# EAGLE design transceiver-v1 (EAGLE 9.5.2)
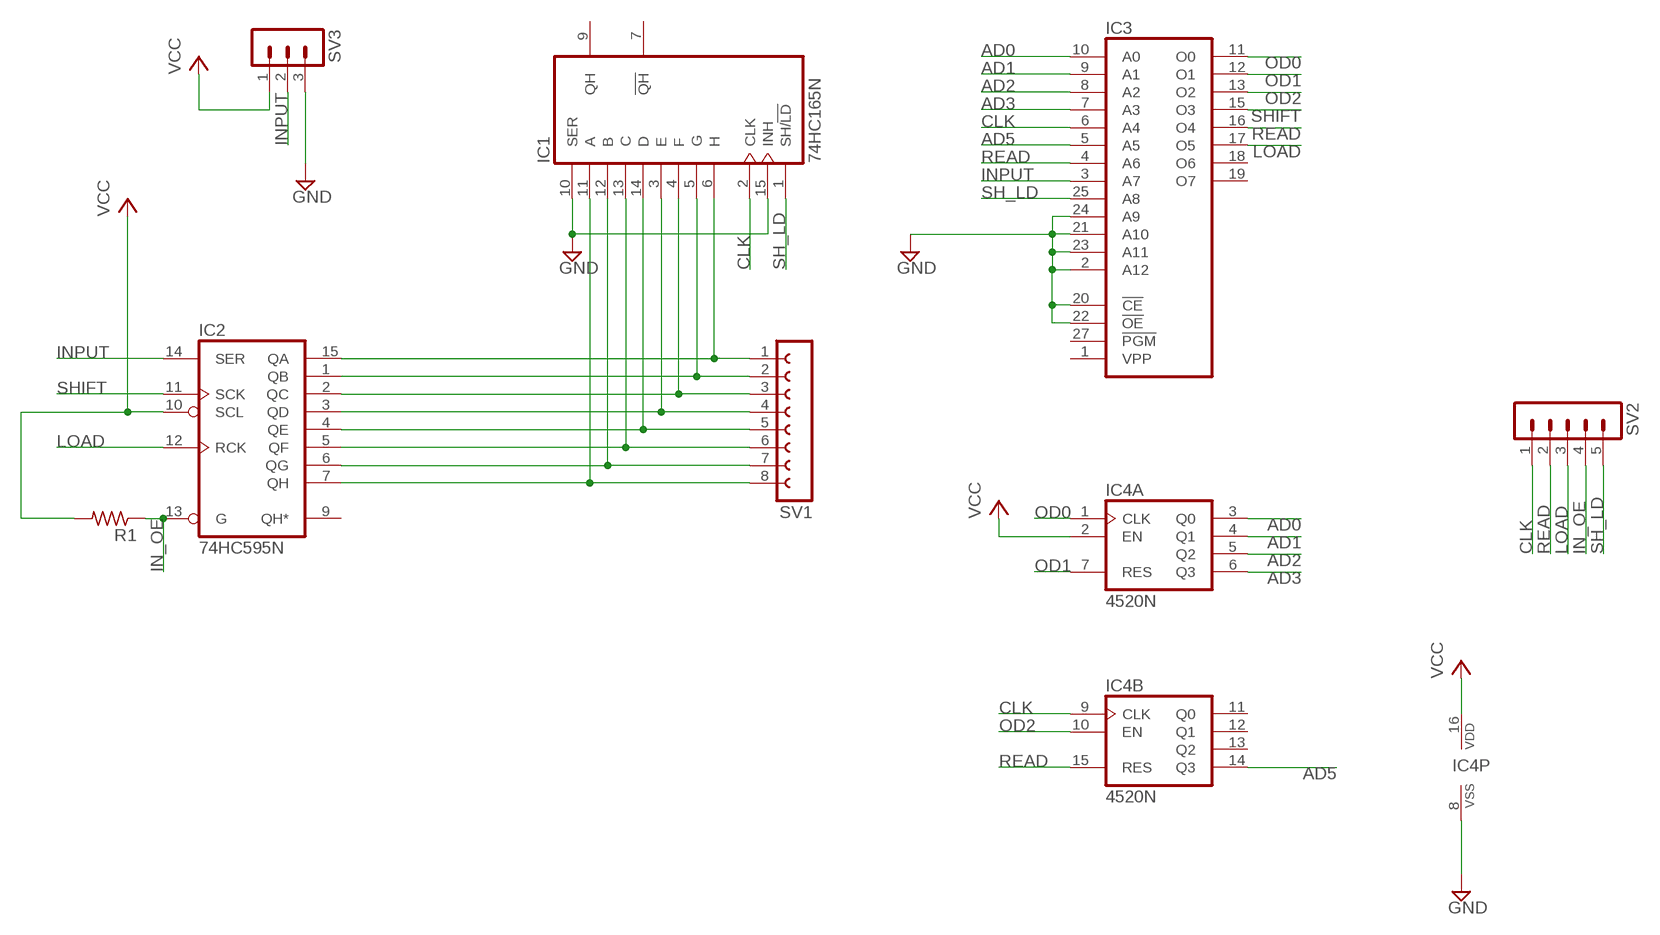
[diagram p0: schematic, sheet 1]

## Parts
IC1  74HC165N  [DIL16]
IC2  74HC595N  [DIL16]
IC3  2764  [DIL28]
IC4  4520N  [DIL16]
R1  R-US_0207/10  [0207/10]
SV1  FE08-1  [FE08]
SV2  MA05-1  [MA05-1]
SV3  MA03-1  [MA03-1]

## Nets
AD0: IC3.10(A0) IC4.3(A:Q0)
AD1: IC3.9(A1) IC4.4(A:Q1)
AD2: IC3.8(A2) IC4.5(A:Q2)
AD3: IC3.7(A3) IC4.6(A:Q3)
AD5: IC3.5(A5) IC4.14(B:Q3)
CLK: IC1.2(CLK) IC3.6(A4) IC4.9(B:CLK) SV2.1
GND: IC1.10(SER) IC1.15(INH) IC3.2(A12) IC3.20(!CE) IC3.21(A10) IC3.22(!OE) IC3.23(A11) IC3.24(A9) IC4.8(P:VSS) SV3.3
IN_OE: IC2.13(G) R1.1 SV2.4
INPUT: IC2.14(SER) IC3.3(A7) SV3.2
LOAD: IC2.12(RCK) IC3.17(O5) SV2.3
N$1: IC1.6(H) IC2.15(QA) SV1.1
N$2: IC1.5(G) IC2.1(QB) SV1.2
N$3: IC1.4(F) IC2.2(QC) SV1.3
N$4: IC1.3(E) IC2.3(QD) SV1.4
N$5: IC1.14(D) IC2.4(QE) SV1.5
N$6: IC1.13(C) IC2.5(QF) SV1.6
N$7: IC1.12(B) IC2.6(QG) SV1.7
N$8: IC1.11(A) IC2.7(QH) SV1.8
OD0: IC3.11(O0) IC4.1(A:CLK)
OD1: IC3.12(O1) IC4.7(A:RES)
OD2: IC3.13(O2) IC4.10(B:EN)
READ: IC3.4(A6) IC3.16(O4) IC4.15(B:RES) SV2.2
SH_LD: IC1.1(SH/!LD) IC3.25(A8) SV2.5
SHIFT: IC2.11(SCK) IC3.15(O3)
VCC: IC2.10(SCL) IC4.2(A:EN) IC4.16(P:VDD) R1.2 SV3.1
Unconnected: IC1.7(!QH) IC1.9(QH) IC2.9(QH*) IC3.1(VPP) IC3.18(O6) IC3.19(O7) IC3.27(!PGM) IC4.11(B:Q0) IC4.12(B:Q1) IC4.13(B:Q2)

## Power pins joined to a net without a drawn wire
GND: IC1.8(GND) IC2.8(GND) IC3.14(GND)
VCC: IC1.16(VCC) IC2.16(VCC) IC3.28(VCC)

## Library data of the parts
IC1 = 74xx-eu:74*165: 8-bit parallel load SHIFT REGISTER
IC2 = 74xx-eu:74*595: 8-bit SHIFT REGISTER, output latch
IC3 = memory:2764: MEMORY
IC4 = 45xx:4520: Dual binary up COUNTER
R1 = rcl:R-US_: RESISTOR, American symbol; SPICEPREFIX: R
SV1 = con-lsta:FE08-1: FEMALE HEADER; OC_FARNELL: unknown; OC_NEWARK: unknown
SV2 = con-lstb:MA05-1: PIN HEADER; OC_FARNELL: unknown; OC_NEWARK: unknown
SV3 = con-lstb:MA03-1: PIN HEADER; OC_FARNELL: unknown; OC_NEWARK: unknown

## Board
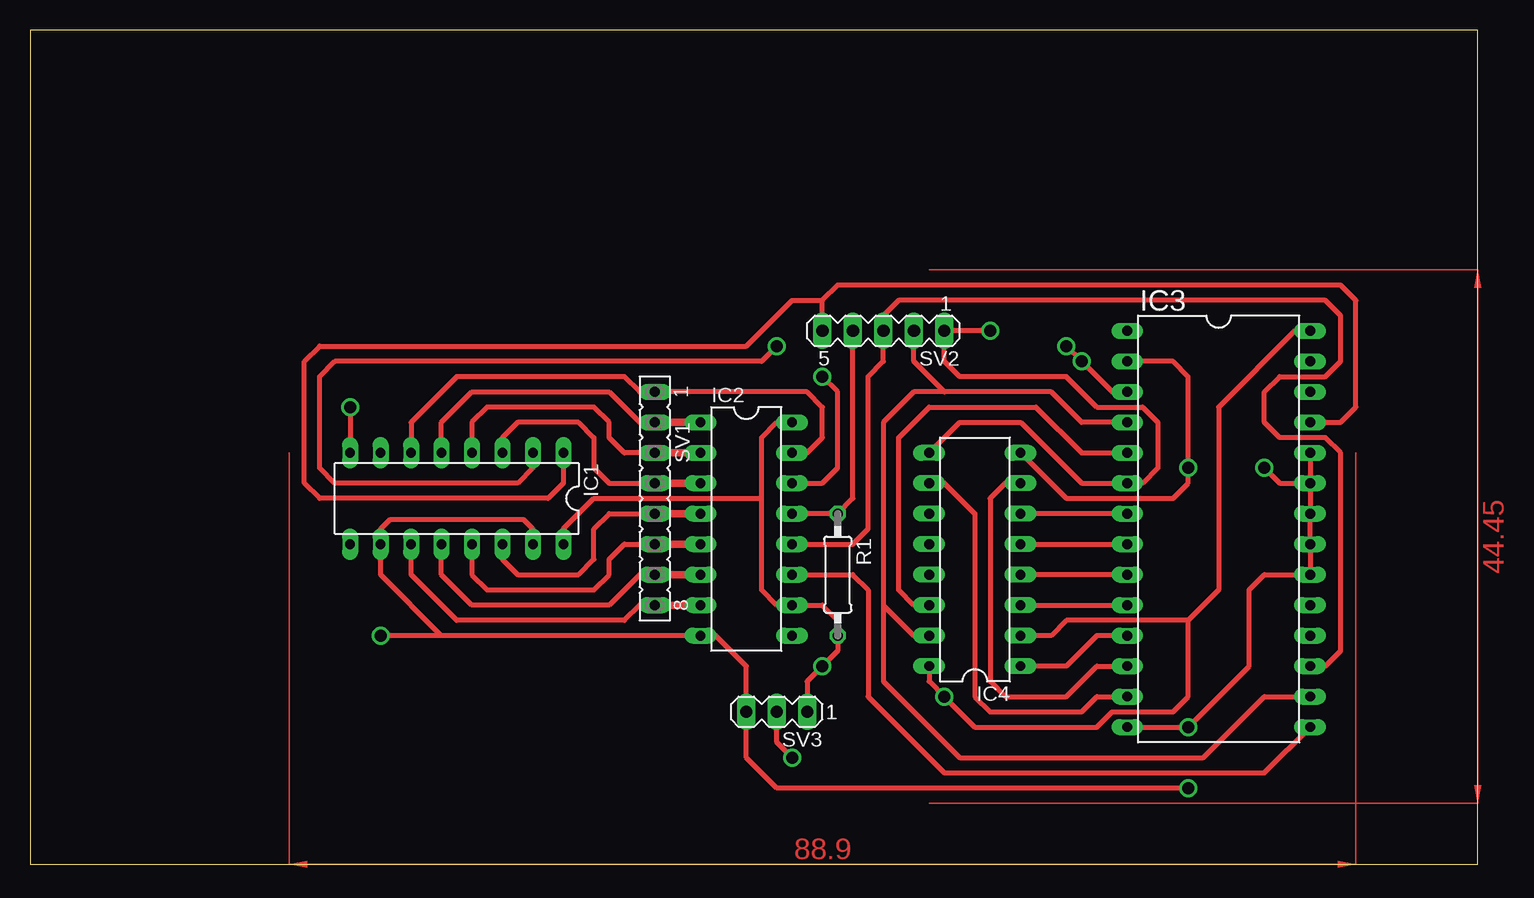
[diagram p1: board, top side]
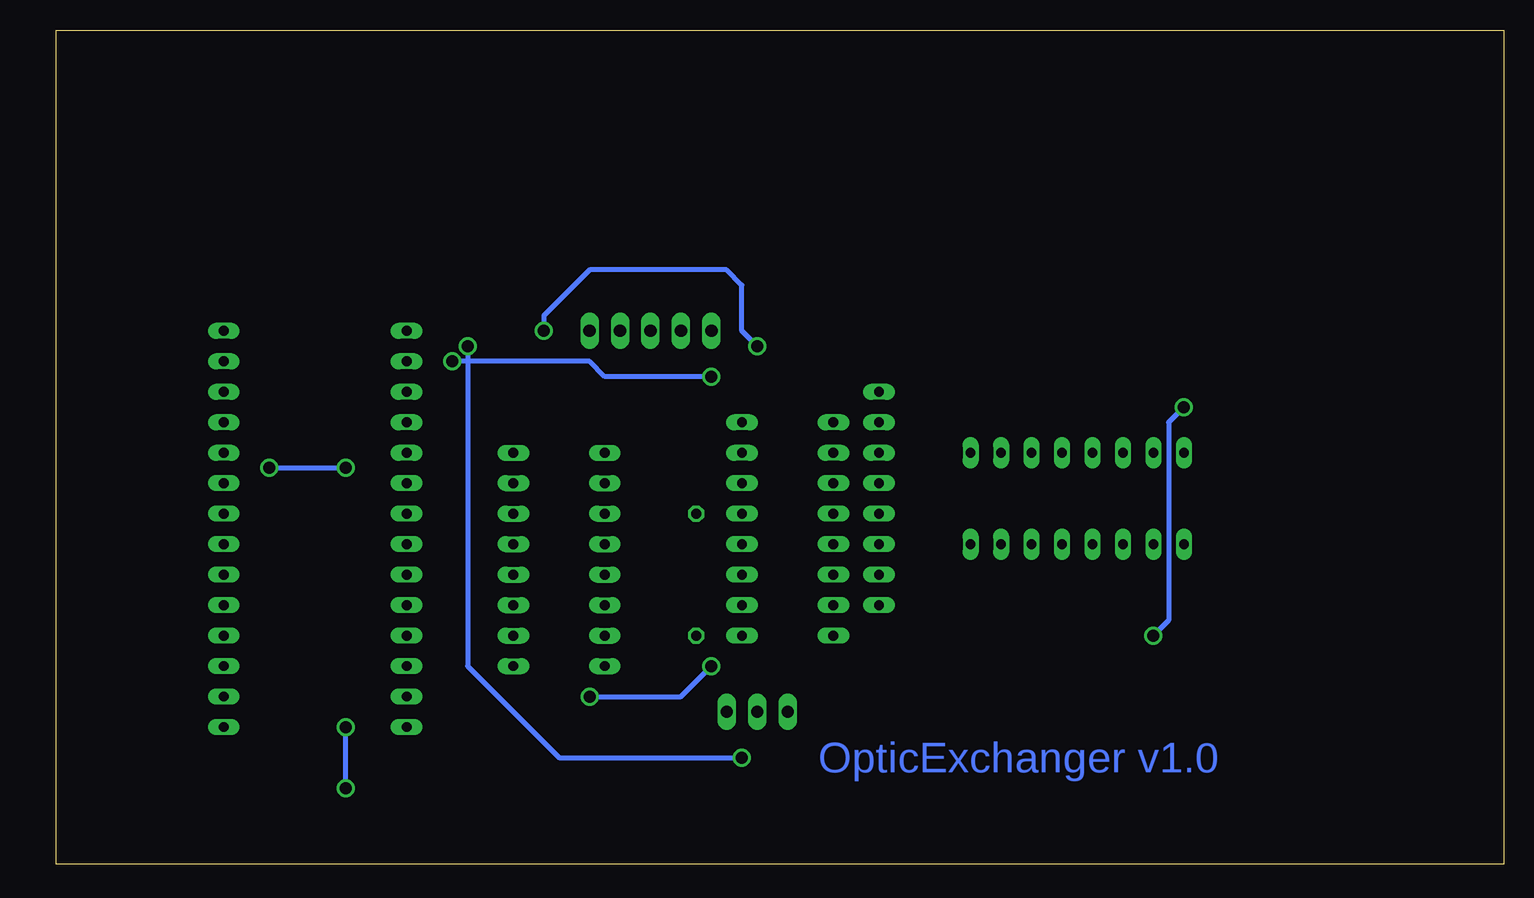
[diagram p2: board, bottom side, seen from below]

Size 120.63 x 69.52 mm. Coordinates in mm from the lower left corner, seen from the top.
Outline: 0,0 120.63,0 120.63,69.52 0,69.52 0,0
Copper layers (1*16): Top 0.035mm / dielectric 1.5mm / Bottom 0.035mm
Design rules "default": minimum track width 6mil, minimum drill 0.35mm, track to track 6mil, track to pad 6mil, pad to pad 6mil, via to via 6mil, smd to smd 6mil, copper to edge 40mil, drill to drill 6mil, minimum pad ring 10mil, minimum via ring 8mil, stop-mask expansion 4mil, vias tented up to drill 0mil, thermal gap 10mil

### Footprints (pad centres in the part's own frame; a part is rotated, then mirrored left to right if it is on the bottom)
DIL16 = drill 0.813 long: 1 -8.89,-3.81; 2 -6.35,-3.81; 3 -3.81,-3.81; 4 -1.27,-3.81; 5 1.27,-3.81; 6 3.81,-3.81; 7 6.35,-3.81; 8 8.89,-3.81; 9 8.89,3.81; 10 6.35,3.81; 11 3.81,3.81; 12 1.27,3.81; 13 -1.27,3.81; 14 -3.81,3.81; 15 -6.35,3.81; 16 -8.89,3.81
DIL28 = drill 0.813 long: 1 -16.51,-7.62; 2 -13.97,-7.62; 3 -11.43,-7.62; 4 -8.89,-7.62; 5 -6.35,-7.62; 6 -3.81,-7.62; 7 -1.27,-7.62; 8 1.27,-7.62; 9 3.81,-7.62; 10 6.35,-7.62; 11 8.89,-7.62; 12 11.43,-7.62; 13 13.97,-7.62; 14 16.51,-7.62; 15 16.51,7.62; 16 13.97,7.62; 17 11.43,7.62; 18 8.89,7.62; 19 6.35,7.62; 20 3.81,7.62; 21 1.27,7.62; 22 -1.27,7.62; 23 -3.81,7.62; 24 -6.35,7.62; 25 -8.89,7.62; 26 -11.43,7.62; 27 -13.97,7.62; 28 -16.51,7.62
0207/10 = drill 0.813 octagon: 1 -5.08,0; 2 5.08,0
FE08 = drill 0.813 long: 1 -8.89,0; 2 -6.35,0; 3 -3.81,0; 4 -1.27,0; 5 1.27,0; 6 3.81,0; 7 6.35,0; 8 8.89,0
MA05-1 = drill 1.016 long: 1 -5.08,0; 2 -2.54,0; 3 0,0; 4 2.54,0; 5 5.08,0
MA03-1 = drill 1.016 long: 1 -2.54,0; 2 0,0; 3 2.54,0

### Placement (x,y rotation side)
IC1  35.56,30.48 180 top
IC2  59.69,27.94 270 top
IC3  99.06,27.94 270 top
IC4  78.74,25.4 90 top
R1  67.31,24.13 270 top
SV1  52.07,30.48 270 top
SV2  71.12,44.45 180 top
SV3  62.23,12.7 180 top

### Tracks (layer width: path | path; a pad name or v marks a point on that pad's centre or on a via)
AD0
  Top 0.406: IC4.3 IC3.10
AD1
  Top 0.406: IC3.9 IC4.4
AD2
  Top 0.406: IC4.5 IC3.8
AD3
  Top 0.406: IC3.7 IC4.6
AD5
  Top 0.406: IC4.14 73.66,21.59 72.39,22.86 72.39,35.56 74.93,38.1 83.82,38.1 87.63,34.29 IC3.5
CLK  (via drill 1)
  Top 0.406: IC4.9 77.47,36.83 82.55,36.83 87.63,31.75 IC3.6 92.71,31.75 93.98,33.02 93.98,36.83 92.71,38.1 88.9,38.1 86.36,40.64 77.47,40.64 76.2,41.91 SV2.1 v80.01,44.45 | IC1.2 41.91,33.02 40.64,31.75 25.4,31.75 24.13,33.02 24.13,40.64 25.4,41.91 60.96,41.91 v62.23,43.18
  Bottom 0.406: v62.23,43.18 63.5,44.45 63.5,48.26 64.77,49.53 76.2,49.53 80.01,45.72 v80.01,44.45
GND  (via drill 1)
  Top 0.406: IC1.15 41.91,27.94 41.15,28.7 29.97,28.7 29.21,27.94 IC1.10 29.21,24.13 34.29,19.05 | 34.29,19.05 IC2.8 57.15,19.05 59.69,16.51 SV3.3 59.69,8.89 62.23,6.35 v96.52,6.35 | IC3.14 v96.52,11.43 101.6,16.51 101.6,22.86 102.87,24.13 IC3.20 IC3.21 IC3.22 IC3.23 | IC3.24 IC3.23 | IC4.8 86.36,30.48 95.25,30.48 96.52,31.75 v96.52,33.02 96.52,40.64 95.25,41.91 IC3.2 | 34.29,19.05 v29.21,19.05 | v26.67,38.1 IC1.8 | v102.87,33.02 104.14,31.75 IC3.23
  Bottom 0.406: v29.21,19.05 27.94,20.32 27.94,36.83 v26.67,38.1 | v102.87,33.02 v96.52,33.02 | v96.52,6.35 v96.52,11.43
IN_OE
  Top 0.406: IC2.13 R1.1 68.58,30.48 SV2.4
INPUT  (via drill 1)
  Top 0.406: IC2.14 66.04,31.75 67.31,33.02 67.31,39.37 v66.04,40.64 | IC3.3 90.17,39.37 v87.63,41.91 v86.36,43.18 | v63.5,8.89 62.23,10.16 SV3.2
  Bottom 0.406: v87.63,41.91 76.2,41.91 74.93,40.64 v66.04,40.64 | v86.36,43.18 86.36,16.51 78.74,8.89 v63.5,8.89
LOAD
  Top 0.406: IC3.17 107.95,16.51 109.22,17.78 109.22,34.29 107.95,35.56 104.14,35.56 102.87,36.83 102.87,39.37 104.14,40.64 107.95,40.64 109.22,41.91 109.22,45.72 107.95,46.99 72.39,46.99 71.12,45.72 SV2.3 71.12,41.91 69.85,40.64 69.85,27.94 68.58,26.67 IC2.12
N$1
  Top 0.406: IC1.6 31.75,36.83 35.56,40.64 49.53,40.64 50.8,39.37 SV1.1 64.77,39.37 66.04,38.1 66.04,35.56 64.77,34.29 IC2.15
N$2
  Top 0.406: IC1.5 34.29,36.83 36.83,39.37 48.26,39.37 50.8,36.83 SV1.2
  Top 0.61: IC2.1 SV1.2
N$3
  Top 0.406: SV1.3 49.53,34.29 48.26,35.56 48.26,36.83 46.99,38.1 38.1,38.1 36.83,36.83 IC1.4
  Top 0.61: IC2.2 SV1.3
N$4
  Top 0.406: SV1.4 48.26,31.75 46.99,33.02 46.99,35.56 45.72,36.83 40.64,36.83 39.37,35.56 IC1.3
  Top 0.61: IC2.3 SV1.4
N$5
  Top 0.406: SV1.5 48.26,29.21 46.99,27.94 46.99,25.4 45.72,24.13 40.64,24.13 39.37,25.4 IC1.14
  Top 0.61: IC2.4 SV1.5
N$6
  Top 0.406: IC1.13 36.83,24.13 38.1,22.86 46.99,22.86 48.26,24.13 48.26,25.4 49.53,26.67 SV1.6
  Top 0.61: IC2.5 SV1.6
N$7
  Top 0.406: SV1.7 50.8,24.13 48.26,21.59 36.83,21.59 34.29,24.13 IC1.12
  Top 0.61: IC2.6 SV1.7
N$8
  Top 0.406: SV1.8 50.8,21.59 49.53,20.32 35.56,20.32 31.75,24.13 IC1.11
  Top 0.61: IC2.7 SV1.8
OD0
  Top 0.406: IC3.11 88.9,19.05 86.36,16.51 IC4.1
OD1
  Top 0.406: IC4.7 81.28,31.75 80.01,30.48 80.01,15.24 81.28,13.97 86.36,13.97 88.9,16.51 IC3.12
OD2
  Top 0.406: IC4.10 76.2,31.75 78.74,29.21 78.74,13.97 80.01,12.7 87.63,12.7 88.9,13.97 IC3.13
READ
  Top 0.406: IC3.4 87.63,36.83 85.09,39.37 76.2,39.37 | 76.2,39.37 73.66,39.37 71.12,36.83 71.12,21.59 | 71.12,21.59 73.66,19.05 IC4.15 | 71.12,21.59 71.12,15.24 77.47,8.89 97.79,8.89 102.87,13.97 IC3.16 | SV2.2 73.66,41.91 76.2,39.37
SH_LD
  Top 0.406: IC1.1 44.45,31.75 43.18,30.48 24.13,30.48 22.86,31.75 22.86,41.91 24.13,43.18 59.69,43.18 63.5,46.99 66.04,46.99 | 66.04,46.99 67.31,48.26 109.22,48.26 110.49,46.99 110.49,38.1 109.22,36.83 IC3.25 | SV2.5 66.04,46.99
SHIFT
  Top 0.406: IC3.15 102.87,7.62 76.2,7.62 69.85,13.97 69.85,22.86 68.58,24.13 IC2.11
VCC  (via drill 1)
  Top 0.406: 60.96,30.48 60.96,22.86 62.23,21.59 IC2.10 66.04,21.59 67.31,20.32 R1.2 67.31,17.78 v66.04,16.51 64.77,15.24 SV3.1 | 60.96,30.48 60.96,35.56 62.23,36.83 IC2.16 | IC1.16 44.45,27.94 46.99,30.48 60.96,30.48 | IC3.28 105.41,44.45 99.06,38.1 99.06,22.86 96.52,20.32 | 96.52,20.32 86.36,20.32 85.09,19.05 IC4.2 | 96.52,20.32 96.52,13.97 95.25,12.7 90.17,12.7 88.9,11.43 78.74,11.43 v76.2,13.97 74.93,15.24 IC4.16
  Bottom 0.406: v76.2,13.97 68.58,13.97 v66.04,16.51
(copper drawn outside any net)
  shapes: Top area x2

### Text on the board
Bottom: OpticExchanger v1.0